# Altium schematic sheet MCU.SchDoc
size 594 x 420 mm; SheetNumber: 4; SheetTotal: 3
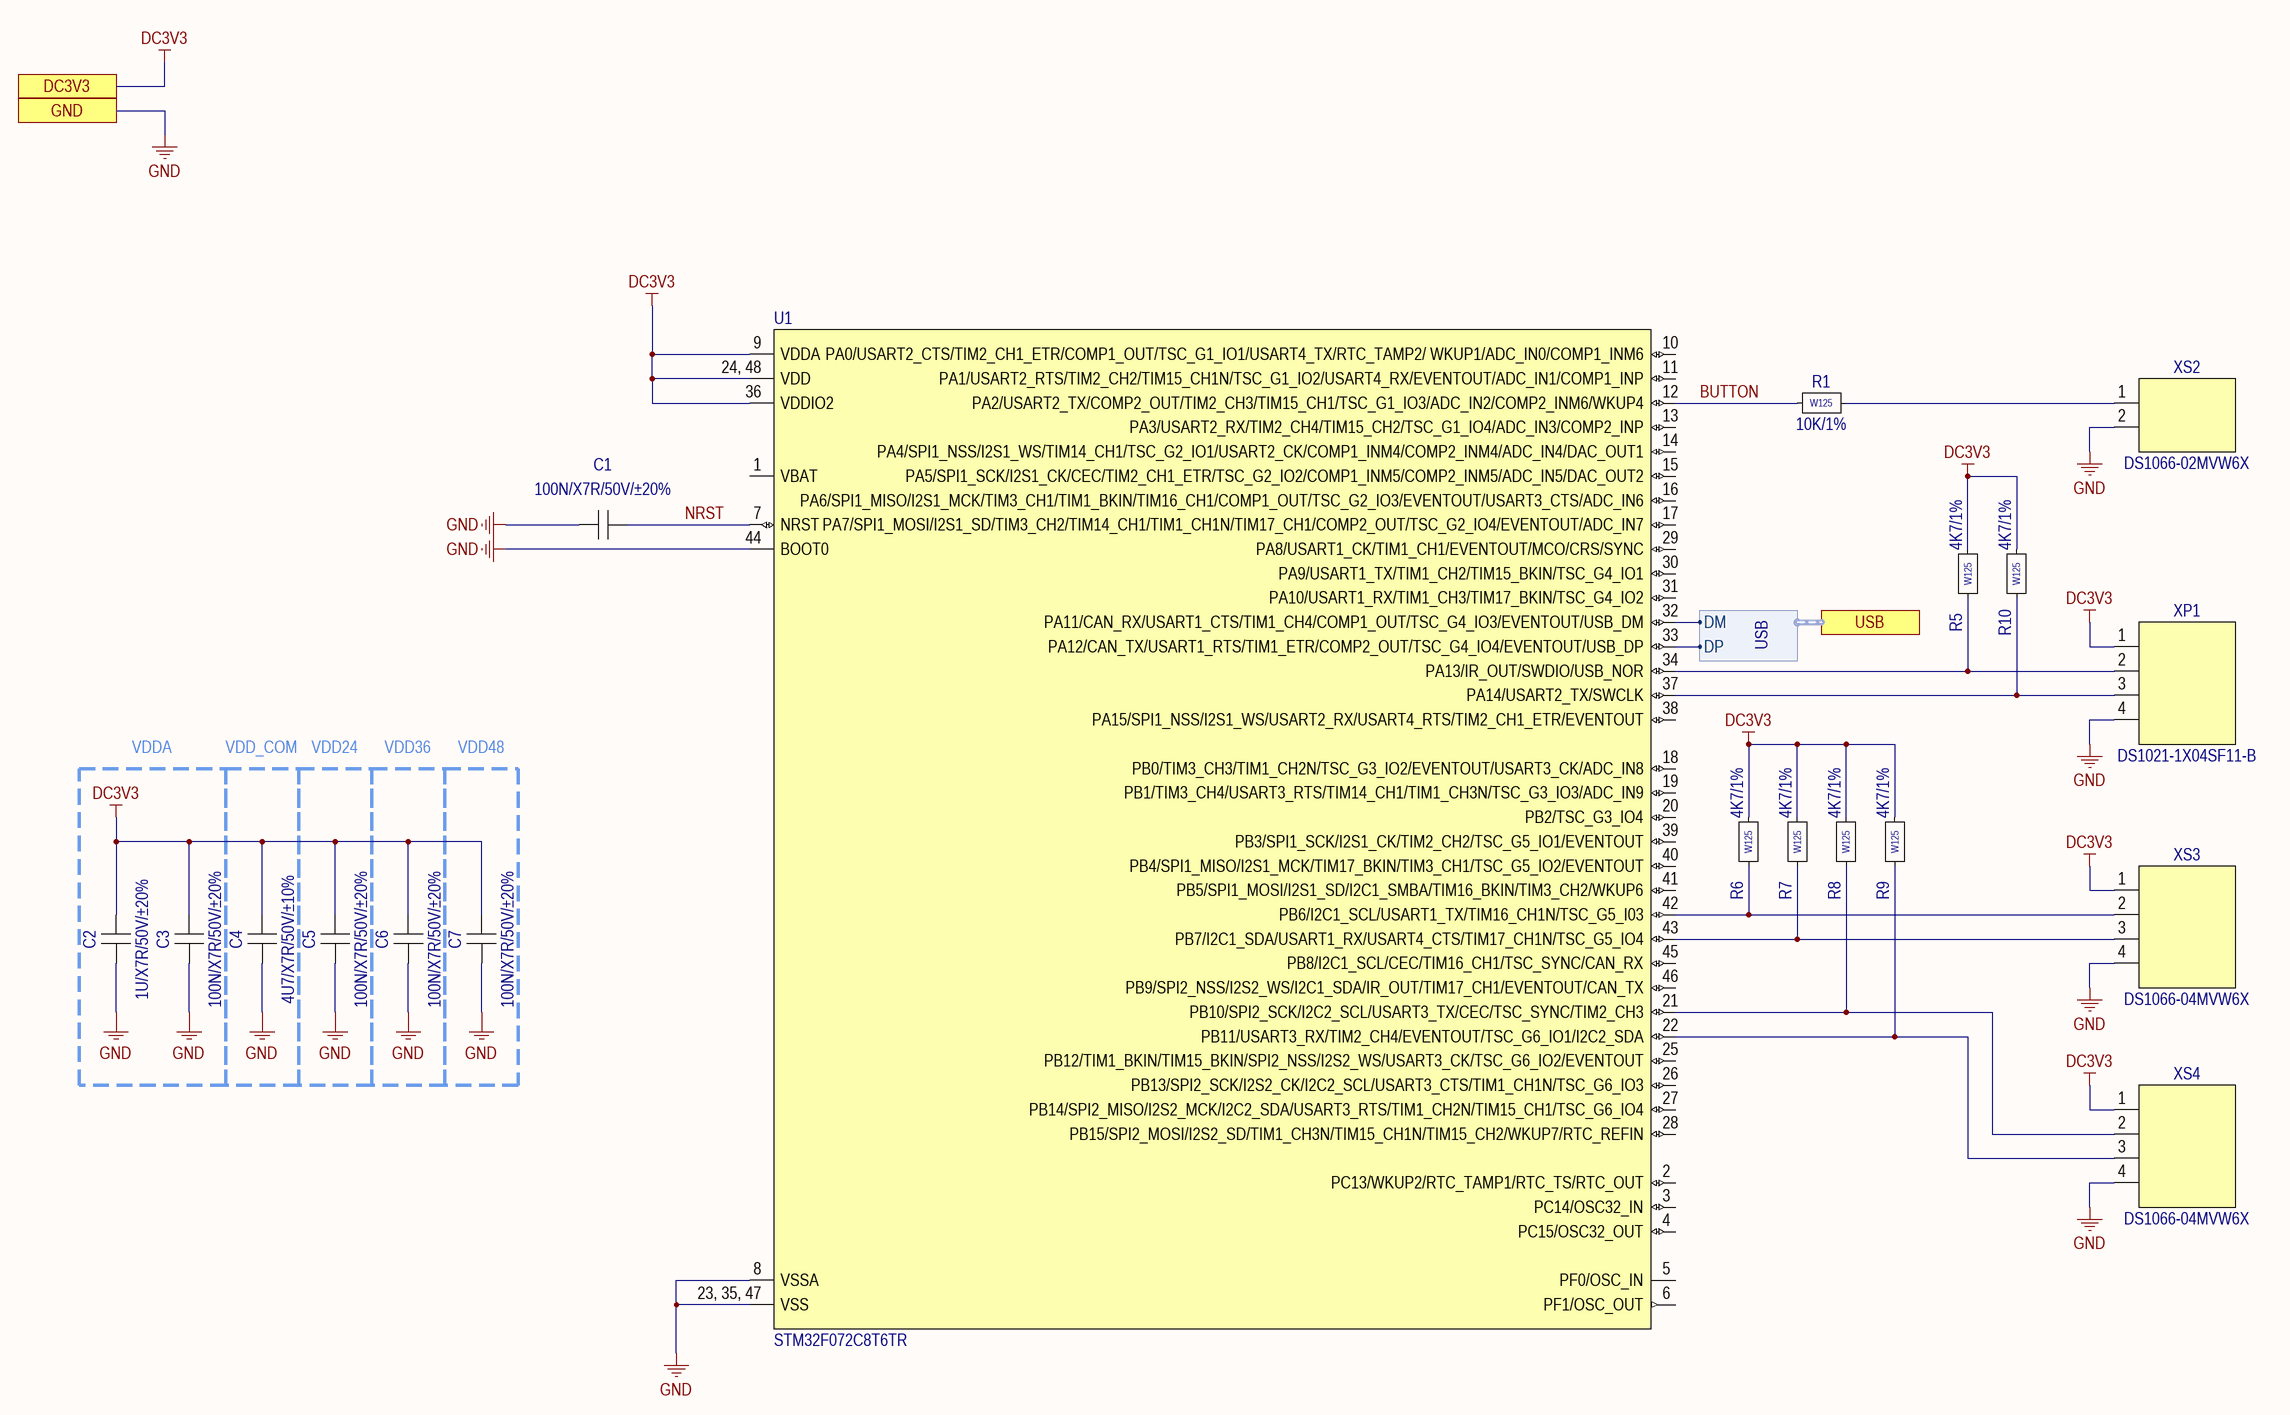
[diagram p0: MCU.SchDoc]

## Parts
C1  value 100N/X7R/50V/±20%  [Normal_Capacitor_Standard_0805-L2000-W1250-BW500-H1350]  (hidden comment: CL21B104MBFNNNE)
C2  value 1U/X7R/50V/±20%  [Normal_Capacitor_Standard_0805-L2000-W1250-BW500-H1350]  (hidden comment: CL21B105MBFNNNE)
C3  value 100N/X7R/50V/±20%  [Normal_Capacitor_Standard_0805-L2000-W1250-BW500-H1350]  (hidden comment: CL21B104MBFNNNE)
C4  value 4U7/X7R/50V/±10%  [Normal_Capacitor_Standard_1206-L3200-W1600-BW1250-H1600]  (hidden comment: CL31B475KBHNNNE)
C5  value 100N/X7R/50V/±20%  [Normal_Capacitor_Standard_0805-L2000-W1250-BW500-H1350]  (hidden comment: CL21B104MBFNNNE)
C6  value 100N/X7R/50V/±20%  [Normal_Capacitor_Standard_0805-L2000-W1250-BW500-H1350]  (hidden comment: CL21B104MBFNNNE)
C7  value 100N/X7R/50V/±20%  [Normal_Capacitor_Standard_0805-L2000-W1250-BW500-H1350]  (hidden comment: CL21B104MBFNNNE)
R1  value 10K/1%  [SMD_RES_0805-L2000-W1250-H500-M1002]  (hidden comment: CR0805-10K-1%)
R5  value 4K7/1%  [SMD_RES_0805-L2000-W1250-H500-M4701]  (hidden comment: CR0805-4K7-1%)
R6  value 4K7/1%  [SMD_RES_0805-L2000-W1250-H500-M4701]  (hidden comment: CR0805-4K7-1%)
R7  value 4K7/1%  [SMD_RES_0805-L2000-W1250-H500-M4701]  (hidden comment: CR0805-4K7-1%)
R8  value 4K7/1%  [SMD_RES_0805-L2000-W1250-H500-M4701]  (hidden comment: CR0805-4K7-1%)
R9  value 4K7/1%  [SMD_RES_0805-L2000-W1250-H500-M4701]  (hidden comment: CR0805-4K7-1%)
R10  value 4K7/1%  [SMD_RES_0805-L2000-W1250-H500-M4701]  (hidden comment: CR0805-4K7-1%)
U1  STM32F072C8T6TR  [48-LQFP]
XP1  DS1021-1X04SF11-B  [DS1021-1X04SF11-B]
XS2  DS1066-02MVW6X  [DS1066-02MVW6X]
XS3  DS1066-04MVW6X  [DS1066-04MVW6X]
XS4  DS1066-04MVW6X  [DS1066-04MVW6X]

## Blocks framed on the sheet
VDDA: C2 C3
VDD_COM: C4
VDD24: C5
VDD36: C6
VDD48: C7

## Ports
DC3V3, GND, USB (harness USB)

## Harnesses
USB: DP, DM

## Nets
DC3V3: C2.2 C3.2 C4.2 C5.2 C6.2 C7.2 R5.2 R6.2 R7.2 R8.2 R9.2 R10.2 U1.9(VDDA) U1.24,_48(VDD) U1.36(VDDIO2) XP1.1 XS3.1 XS4.1 ; port DC3V3
GND: C1.1 C2.1 C3.1 C4.1 C5.1 C6.1 C7.1 U1.8(VSSA) U1.23,_35,_47(VSS) U1.44(BOOT0) XP1.4 XS2.2 XS3.4 XS4.4 ; port GND
BUTTON: R1.1 U1.12(PA2/USART2_TX/COMP2_OUT/TIM2_CH3/TIM15_CH1/TSC_G1_IO3/ADC_IN2/COMP2_INM6/WKUP4)
NRST: C1.2 U1.7(NRST)
NetR1_2: R1.2 XS2.1
NetR5_1: R5.1 U1.34(PA13/IR_OUT/SWDIO/USB_NOR) XP1.2
NetR6_1: R6.1 U1.42(PB6/I2C1_SCL/USART1_TX/TIM16_CH1N/TSC_G5_I03) XS3.2
NetR7_1: R7.1 U1.43(PB7/I2C1_SDA/USART1_RX/USART4_CTS/TIM17_CH1N/TSC_G5_IO4) XS3.3
NetR8_1: R8.1 U1.21(PB10/SPI2_SCK/I2C2_SCL/USART3_TX/CEC/TSC_SYNC/TIM2_CH3) XS4.2
NetR9_1: R9.1 U1.22(PB11/USART3_RX/TIM2_CH4/EVENTOUT/TSC_G6_IO1/I2C2_SDA) XS4.3
NetR10_1: R10.1 U1.37(PA14/USART2_TX/SWCLK) XP1.3
NetU1_32: U1.32(PA11/CAN_RX/USART1_CTS/TIM1_CH4/COMP1_OUT/TSC_G4_IO3/EVENTOUT/USB_DM) ; port USB.DM
NetU1_33: U1.33(PA12/CAN_TX/USART1_RTS/TIM1_ETR/COMP2_OUT/TSC_G4_IO4/EVENTOUT/USB_DP) ; port USB.DP

Not connected (* = marked no-connect by the designer): U1 1(VBAT) 2(PC13/WKUP2/RTC_TAMP1/RTC_TS/RTC_OUT) 3(PC14/OSC32_IN) 4(PC15/OSC32_OUT) 5(PF0/OSC_IN) 6(PF1/OSC_OUT) 10(PA0/USART2_CTS/TIM2_CH1_ETR/COMP1_OUT/TSC_G1_IO1/USART4_TX/RTC_TAMP2/_WKUP1/ADC_IN0/COMP1_INM6) 11(PA1/USART2_RTS/TIM2_CH2/TIM15_CH1N/TSC_G1_IO2/USART4_RX/EVENTOUT/ADC_IN1/COMP1_INP) 13(PA3/USART2_RX/TIM2_CH4/TIM15_CH2/TSC_G1_IO4/ADC_IN3/COMP2_INP) 14(PA4/SPI1_NSS/I2S1_WS/TIM14_CH1/TSC_G2_IO1/USART2_CK/COMP1_INM4/COMP2_INM4/ADC_IN4/DAC_OUT1) 15(PA5/SPI1_SCK/I2S1_CK/CEC/TIM2_CH1_ETR/TSC_G2_IO2/COMP1_INM5/COMP2_INM5/ADC_IN5/DAC_OUT2) 16(PA6/SPI1_MISO/I2S1_MCK/TIM3_CH1/TIM1_BKIN/TIM16_CH1/COMP1_OUT/TSC_G2_IO3/EVENTOUT/USART3_CTS/ADC_IN6) 17(PA7/SPI1_MOSI/I2S1_SD/TIM3_CH2/TIM14_CH1/TIM1_CH1N/TIM17_CH1/COMP2_OUT/TSC_G2_IO4/EVENTOUT/ADC_IN7) 18(PB0/TIM3_CH3/TIM1_CH2N/TSC_G3_IO2/EVENTOUT/USART3_CK/ADC_IN8) 19(PB1/TIM3_CH4/USART3_RTS/TIM14_CH1/TIM1_CH3N/TSC_G3_IO3/ADC_IN9) 20(PB2/TSC_G3_IO4) 25(PB12/TIM1_BKIN/TIM15_BKIN/SPI2_NSS/I2S2_WS/USART3_CK/TSC_G6_IO2/EVENTOUT) 26(PB13/SPI2_SCK/I2S2_CK/I2C2_SCL/USART3_CTS/TIM1_CH1N/TSC_G6_IO3) 27(PB14/SPI2_MISO/I2S2_MCK/I2C2_SDA/USART3_RTS/TIM1_CH2N/TIM15_CH1/TSC_G6_IO4) 28(PB15/SPI2_MOSI/I2S2_SD/TIM1_CH3N/TIM15_CH1N/TIM15_CH2/WKUP7/RTC_REFIN) 29(PA8/USART1_CK/TIM1_CH1/EVENTOUT/MCO/CRS/SYNC) 30(PA9/USART1_TX/TIM1_CH2/TIM15_BKIN/TSC_G4_IO1) 31(PA10/USART1_RX/TIM1_CH3/TIM17_BKIN/TSC_G4_IO2) 38(PA15/SPI1_NSS/I2S1_WS/USART2_RX/USART4_RTS/TIM2_CH1_ETR/EVENTOUT) 39(PB3/SPI1_SCK/I2S1_CK/TIM2_CH2/TSC_G5_IO1/EVENTOUT) 40(PB4/SPI1_MISO/I2S1_MCK/TIM17_BKIN/TIM3_CH1/TSC_G5_IO2/EVENTOUT) 41(PB5/SPI1_MOSI/I2S1_SD/I2C1_SMBA/TIM16_BKIN/TIM3_CH2/WKUP6) 45(PB8/I2C1_SCL/CEC/TIM16_CH1/TSC_SYNC/CAN_RX) 46(PB9/SPI2_NSS/I2S2_WS/I2C1_SDA/IR_OUT/TIM17_CH1/EVENTOUT/CAN_TX)

## Notes on the sheet
- Подп. и дата
- Инв. № дубл.
- Взам. инв. №
- Инв № подл.
- Изм.
- Лист
- № докум.
- Подп.
- Дата
- Стр.
- Формат А2
- (in symbol CR0805-4K7-1%) W125
- (in symbol CR0805-10K-1%) W125

## Library data of the parts
C1 C3 C5-C7 = CL21B104MBFNNNE: Ceramic Capacitor SMD 0805
C2 = CL21B105MBFNNNE: Ceramic Capacitor SMD 0805
C4 = CL31B475KBHNNNE: Ceramic Capacitor SMD 0805
R1 = CR0805-10K-1%: Film resistor SMD 0805
R5-R10 = CR0805-4K7-1%: Film resistor SMD 0805
U1 = STM32F072C8T6TR: Arm®-based 32-bit MCU, up to 128 KB Flash, crystal-less USB / FS 2.0, CAN, 12 timers, ADC, DAC & comm. interfaces, 2.0 - 3.6 V; pin to pad: 23, 35, 47>23+35+47 24, 48>24+48
XS2 = DS1066-02MVW6X: Manufacturer: CONNFLY ELECTRONIC CO.,LTD.
XS3 XS4 = DS1066-04MVW6X: Manufacturer: CONNFLY ELECTRONIC CO.,LTD.